# EAGLE schematic daughterboard (EAGLE 4.16)
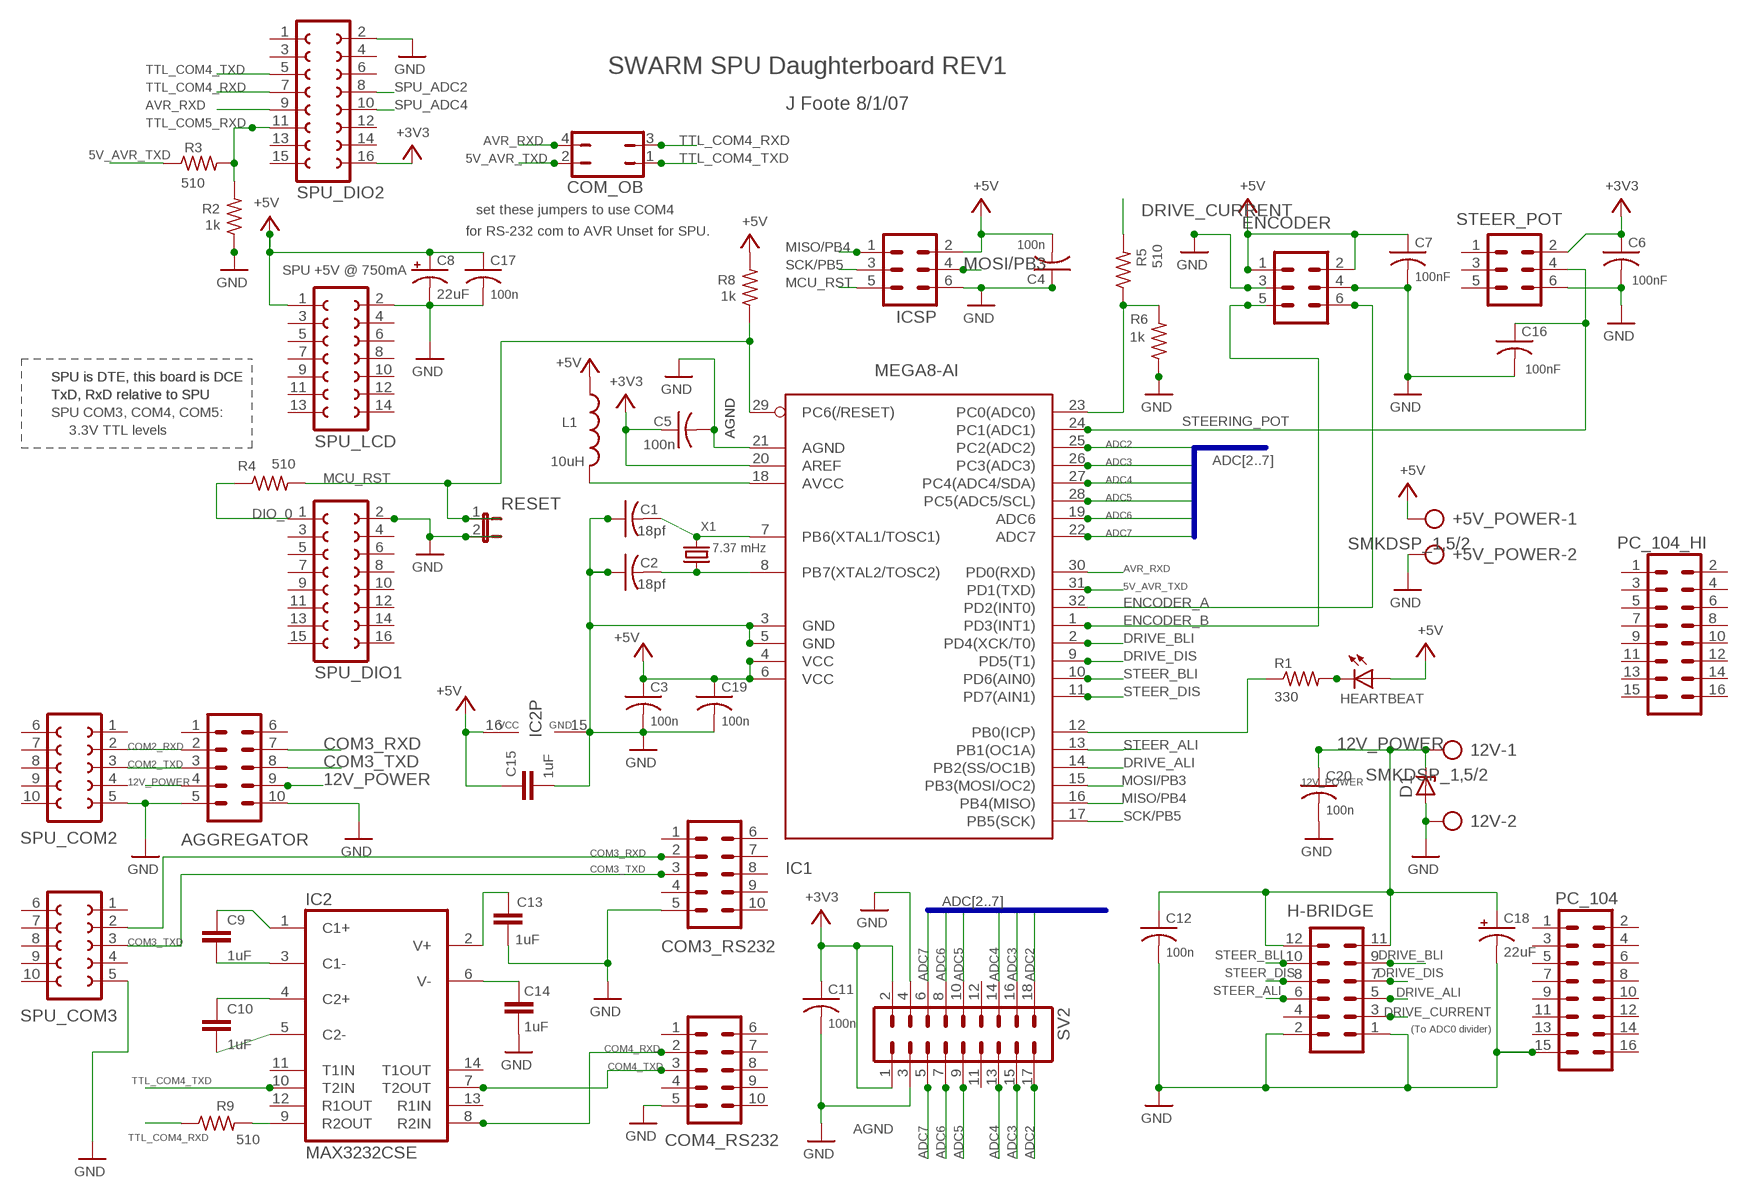
[diagram p0: schematic, sheet 1]

## Parts
12V  SMKDSP_1,5/2  [SMKDSP_1,5/2]
+5V_POWER  SMKDSP_1,5/2  [SMKDSP_1,5/2]
AGGREGATOR  COMHEADER-M  [MA05-2]
C1  18pf  C-USC1206  [C1206]
C2  18pf  C-USC1206  [C1206]
C3  100n  C-USC1206  [C1206]
C4  100n  C-USC1206  [C1206]
C5  100n  C-USC1206  [C1206]
C6  100nF  C-USC1206  [C1206]
C7  100nF  C-USC1206  [C1206]
C8  22uF  CPOL-USCT7343  [CT7343]
C9  1uF  C-EUC1206  [C1206]
C10  1uF  C-EUC1206  [C1206]
C11  100n  C-USC1206  [C1206]
C12  100n  C-USC1206  [C1206]
C13  1uF  C-EUC1206  [C1206]
C14  1uF  C-EUC1206  [C1206]
C15  1uF  C-EUC1206  [C1206]
C16  100nF  C-USC1206  [C1206]
C17  100n  C-USC1206  [C1206]
C18  22uF  CPOL-USCT7343  [CT7343]
C19  100n  C-USC1206  [C1206]
C20  100n  C-USC1206  [C1206]
COM3_RS232  COMHEADER-M  [MA05-2]
COM4_RS232  COMHEADER-M  [MA05-2]
COM_OB  JP2Q  [JP2Q]
D1  ZENER-DIODEDO41Z10  [DO41Z10]
ENCODER  MA03-2  [MA03-2]
H-BRIDGE  MA06-2  [MA06-2]
HEARTBEAT  LEDSMT1206  [1206]
IC1  MEGA8-AI  [TQFP32-08]
IC2  MAX3232CSE  [SO16]
ICSP  MA03-2  [MA03-2]
L1  10uH  L-USL1812  [L1812]
PC_104  MA08-2  [MA08-2]
PC_104_HI  MA08-2  [MA08-2]
R1  330  R-US_M1206  [M1206]
R2  1k  R-US_M1206  [M1206]
R3  510  R-US_M1206  [M1206]
R4  510  R-US_M1206  [M1206]
R5  510  R-US_M1206  [M1206]
R6  1k  R-US_M1206  [M1206]
R8  1k  R-US_M1206  [M1206]
R9  510  R-US_M1206  [M1206]
RESET  JP1E  [JP1]
SPU_COM2  COMHEADER  [FE05-2]
SPU_COM3  COMHEADER  [FE05-2]
SPU_DIO1  FE08-2  [FE08-2]
SPU_DIO2  FE08-2  [FE08-2]
SPU_LCD  FE07-2  [FE07-2]
STEER_POT  MA03-2  [MA03-2]
SV2  MA09-2  [MA09-2]
X1  7.37 mHz  CRYSTALHC49UP  [HC49UP]

## Nets
5V_AVR_TXD: COM_OB.2 IC1.31(PD1(TXD)) R3.1
12V_POWER: 12V.1 AGGREGATOR.4 AGGREGATOR.9 C12.1 C18.+ C20.1 D1.C H-BRIDGE.11 H-BRIDGE.12
+3V3 [GND]: C5.1 C6.1 C11.1 IC1.20(AREF) SPU_DIO2.16 STEER_POT.2 SV2.1 SV2.2
+5V: +5V_POWER.1 C3.1 C4.2 C7.1 C8.+ C15.1 C17.1 C19.1 ENCODER.1 ENCODER.2 HEARTBEAT.A IC1.4(VCC) IC1.6(VCC) IC2.16(VCC) ICSP.2 L1.1 R8.2 SPU_LCD.1
ADC2: IC1.25(PC2(ADC2)) SV2.17 SV2.18
ADC3: IC1.26(PC3(ADC3)) SV2.15 SV2.16
ADC4: IC1.27(PC4(ADC4/SDA)) SV2.13 SV2.14
ADC5: IC1.28(PC5(ADC5/SCL)) SV2.9 SV2.10
ADC6: IC1.19(ADC6) SV2.7 SV2.8
ADC7: IC1.22(ADC7) SV2.5 SV2.6
AVR_RXD: COM_OB.4 IC1.30(PD0(RXD)) SPU_DIO2.9
COM2_RXD: AGGREGATOR.2 SPU_COM2.2
COM2_TXD: AGGREGATOR.3 SPU_COM2.3
COM3_RXD: AGGREGATOR.7 COM3_RS232.2 SPU_COM3.2
COM3_TXD: AGGREGATOR.8 COM3_RS232.3 SPU_COM3.3
COM4_RXD: COM4_RS232.2 IC2.8(R2IN)
COM4_TXD: COM4_RS232.3 IC2.7(T2OUT)
CURRENT_SENSE: IC1.23(PC0(ADC0)) R5.1 R6.2
DIO_0: R4.1 SPU_DIO1.1
DRIVE_ALI: H-BRIDGE.5 IC1.14(PB2(SS/OC1B))
DRIVE_BLI: H-BRIDGE.9 IC1.2(PD4(XCK/T0))
DRIVE_CURRENT: H-BRIDGE.3 R5.2
DRIVE_DIS: H-BRIDGE.7 IC1.9(PD5(T1))
ENCODER_A: ENCODER.6 IC1.32(PD2(INT0))
ENCODER_B: ENCODER.5 IC1.1(PD3(INT1))
GND [GND]: 12V.2 +5V_POWER.2 AGGREGATOR.5 AGGREGATOR.10 C1.1 C2.1 C3.2 C4.1 C5.2 C6.2 C7.2 C8.- C11.2 C12.2 C13.2 C14.2 C15.2 C16.2 C17.2 C18.- C19.2 C20.2 COM3_RS232.5 COM4_RS232.5 D1.A ENCODER.3 ENCODER.4 H-BRIDGE.1 H-BRIDGE.2 IC1.3(GND) IC1.5(GND) IC1.21(AGND) IC2.15(GND) ICSP.6 PC_104.15 R2.1 R6.1 RESET.2 SPU_COM2.5 SPU_COM3.5 SPU_DIO1.2 SPU_DIO2.2 SPU_LCD.2 STEER_POT.6 SV2.3 SV2.4
MCU_RST: IC1.29(PC6(/RESET)) ICSP.5 R4.2 R8.1 RESET.1
MISO/PB4: IC1.16(PB4(MISO)) ICSP.1
MOSI/PB3: IC1.15(PB3(MOSI/OC2)) ICSP.4
N$1: IC1.12(PB0(ICP)) R1.1
N$3: HEARTBEAT.C R1.2
N$4 [GND]: C1.2 IC1.7(PB6(XTAL1/TOSC1)) X1.2
N$5: IC1.18(AVCC) L1.2
N$7: C14.1 IC2.6(V-)
N$9 [GND]: C2.2 IC1.8(PB7(XTAL2/TOSC2)) X1.1
N$10: C10.1 IC2.4(C2+)
N$11: C13.1 IC2.2(V+)
N$12: C10.2 IC2.5(C2-)
N$13: C9.2 IC2.3(C1-)
N$15: C9.1 IC2.1(C1+)
N$16: IC2.9(R2OUT) R9.2
SCK/PB5: IC1.17(PB5(SCK)) ICSP.3
SPU_ADC2: SPU_DIO2.8
SPU_ADC4: SPU_DIO2.10
STEER_ALI: H-BRIDGE.6 IC1.13(PB1(OC1A))
STEER_BLI [GND]: H-BRIDGE.10 IC1.10(PD6(AIN0))
STEER_DIS: H-BRIDGE.8 IC1.11(PD7(AIN1))
STEERING_POT: C16.1 IC1.24(PC1(ADC1)) STEER_POT.4
TTL_COM4_RXD: COM_OB.3 R9.1 SPU_DIO2.7
TTL_COM4_TXD: COM_OB.1 IC2.10(T2IN) SPU_DIO2.5
TTL_COM5_RXD: R2.2 R3.2 SPU_DIO2.11
Unconnected: AGGREGATOR.1 AGGREGATOR.6 COM3_RS232.1 COM3_RS232.4 COM3_RS232.6 COM3_RS232.7 COM3_RS232.8 COM3_RS232.9 COM3_RS232.10 COM4_RS232.1 COM4_RS232.4 COM4_RS232.6 COM4_RS232.7 COM4_RS232.8 COM4_RS232.9 COM4_RS232.10 H-BRIDGE.4 IC2.11(T1IN) IC2.12(R1OUT) IC2.13(R1IN) IC2.14(T1OUT) PC_104.1 PC_104.2 PC_104.3 PC_104.4 PC_104.5 PC_104.6 PC_104.7 PC_104.8 PC_104.9 PC_104.10 PC_104.11 PC_104.12 PC_104.13 PC_104.14 PC_104.16 PC_104_HI.1 PC_104_HI.2 PC_104_HI.3 PC_104_HI.4 PC_104_HI.5 PC_104_HI.6 PC_104_HI.7 PC_104_HI.8 PC_104_HI.9 PC_104_HI.10 PC_104_HI.11 PC_104_HI.12 PC_104_HI.13 PC_104_HI.14 PC_104_HI.15 PC_104_HI.16 SPU_COM2.1 SPU_COM2.4 SPU_COM2.6 SPU_COM2.7 SPU_COM2.8 SPU_COM2.9 SPU_COM2.10 SPU_COM3.1 SPU_COM3.4 SPU_COM3.6 SPU_COM3.7 SPU_COM3.8 SPU_COM3.9 SPU_COM3.10 SPU_DIO1.3 SPU_DIO1.4 SPU_DIO1.5 SPU_DIO1.6 SPU_DIO1.7 SPU_DIO1.8 SPU_DIO1.9 SPU_DIO1.10 SPU_DIO1.11 SPU_DIO1.12 SPU_DIO1.13 SPU_DIO1.14 SPU_DIO1.15 SPU_DIO1.16 SPU_DIO2.1 SPU_DIO2.3 SPU_DIO2.4 SPU_DIO2.6 SPU_DIO2.12 SPU_DIO2.13 SPU_DIO2.14 SPU_DIO2.15 SPU_LCD.3 SPU_LCD.4 SPU_LCD.5 SPU_LCD.6 SPU_LCD.7 SPU_LCD.8 SPU_LCD.9 SPU_LCD.10 SPU_LCD.11 SPU_LCD.12 SPU_LCD.13 SPU_LCD.14 STEER_POT.1 STEER_POT.3 STEER_POT.5 SV2.11 SV2.12

## Buses
ADC[2..7]

## Notes on the sheet
- SWARM SPU Daughterboard REV1
- J Foote 8/1/07
- set these jumpers to use COM4
- for RS-232 com to AVR Unset for SPU.
- SPU +5V @ 750mA
- SPU is DTE, this board is DCE | SPU is DTE, this board is DCE
- TxD, RxD relative to SPU | TxD, RxD relative to SPU | AGND | AGND
- SPU COM3, COM4, COM5:
- 3.3V TTL levels
- (To ADC0 divider)
- AGND

## Library data of the parts
12V +5V_POWER = con-phoenix-smkdsp:SMKDSP_1,5/2: Printklemme, Nennstrom: 17,5 A, Bemessungsspannung: 250 V, Raster: 5,0 mm Source: http://eshop.phoenixcontact.de .. 1733415.pdf
AGGREGATOR COM3_RS232 COM4_RS232 = foote:COMHEADER-M
C1-C7 C11 C12 C16 C17 C19 C20 = rcl:C-US: CAPACITOR, American symbol
C8 C18 = rcl:CPOL-US: POLARIZED CAPACITOR, American symbol
C9 C10 C13-C15 = rcl:C-EU: CAPACITOR, European symbol
COM_OB = jumper:JP2Q: JUMPER
D1 = diode:ZENER-DIODE: Z-Diode
ENCODER ICSP STEER_POT = con-lstb:MA03-2: PIN HEADER
H-BRIDGE = con-lstb:MA06-2: PIN HEADER
HEARTBEAT = led:LED: LED OSRAM: - CHIPLED LG R971, LG N971, LY N971, LG Q971, LY Q971, LO R971, LY R971 LH N974, LH R974 LS Q976, LO Q976, LY Q976 LO Q996 - Hyper CHIPLED LW Q18S LB Q993, LB Q99A, LB R99A - SideLED LS A670, LO A670, LY A670, LG A670, LP A670 LB A673, LV A673, LT A673, LW A673 LH A674 LY A675 LS A676, LA A676, LO A676, LY A676, LW A676 LS A679, LY A679, LG A679 - Hyper Micro SIDELED® LS Y876, LA Y876, LO Y876, LY Y876 LT Y87S - SmartLED LW L88C, LW L88S LB L89C, LB L89S, LG L890 LS L89K, LO L89K, LY L89K LS L896, LA L896, LO L896, LY L896 - TOPLED LS T670, LO T670, LY T670, LG T670, LP T670 LSG T670, LSP T670, LSY T670, LOP T670, LYG T670 LG T671, LOG T671, LSG T671 LB T673, LV T673, LT T673, LW T673 LH T674 LS T676, LA T676, LO T676, LY T676, LB T676, LH T676, LSB T676, LW T676 LB T67C, LV T67C, LT T67C, LS T67K, LO T67K, LY T67K, LW E67C LS E67B, LA E67B, LO E67B, LY E67B, LB E67C, LV E67C, LT E67C LW T67C LS T679, LY T679, LG T679 LS T770, LO T770, LY T770, LG T770, LP T770 LB T773, LV T773, LT T773, LW T773 LH T774 LS E675, LA E675, LY E675, LS T675 LS T776, LA T776, LO T776, LY T776, LB T776 LHGB T686 LT T68C, LB T68C - Hyper Mini TOPLED® LB M676 - Mini TOPLED Santana® LG M470 LS M47K, LO M47K, LY M47K Source: http://www.osram.convergy.de - LUMILED® LXK2-PW12-R00, LXK2-PW12-S00, LXK2-PW14-U00, LXK2-PW14-V00 LXK2-PM12-R00, LXK2-PM12-S00, LXK2-PM14-U00 LXK2-PE12-Q00, LXK2-PE12-R00, LXK2-PE12-S00, LXK2-PE14-T00, LXK2-PE14-U00 LXK2-PB12-K00, LXK2-PB12-L00, LXK2-PB12-M00, LXK2-PB14-N00, LXK2-PB14-P00, LXK2-PB14-Q00 LXK2-PR12-L00, LXK2-PR12-M00, LXK2-PR14-Q00, LXK2-PR14-R00 LXK2-PD12-Q00, LXK2-PD12-R00, LXK2-PD12-S00 LXK2-PH12-R00, LXK2-PH12-S00 LXK2-PL12-P00, LXK2-PL12-Q00, LXK2-PL12-R00 Source: www.luxeon.com
IC1 = atmel:MEGA8: MICROCONTROLLER 8 Kbytes FLASH 1 kbytes SRAM 512 bytes EEPROM USART 6-channel 10 bit ADC 2-channel 8 bit ADC Source: avr.lbr
IC2 = maxim:MAX3232*: True RS-232 Transceivers 3.0V to 5.5V, Low-Power up to 1Mbps, Using Four 0.1µF External Capacitors Source: http://pdfserv.maxim-ic.com/en/ds/MAX3222-MAX3241.pdf
L1 = rcl:L-US: INDUCTOR, American symbol
PC_104 PC_104_HI = con-lstb:MA08-2: PIN HEADER
R1-R6 R8 R9 = rcl:R-US_: RESISTOR, American symbol
RESET = jumper:JP1E: JUMPER
SPU_COM2 SPU_COM3 = foote:COMHEADER
SPU_DIO1 SPU_DIO2 = con-lsta:FE08-2: FEMALE HEADER
SPU_LCD = con-lsta:FE07-2: FEMALE HEADER
SV2 = con-lstb:MA09-2: PIN HEADER
X1 = crystal:CRYSTAL: CRYSTAL